# Altium project Control_Board_Model_C.PrjPcb (part 2 of 3)

## Sheet Motor Connection.SchDoc: Motor Connection
size A4; DocumentNumber: 12; SheetNumber: 12; SheetTotal: 51
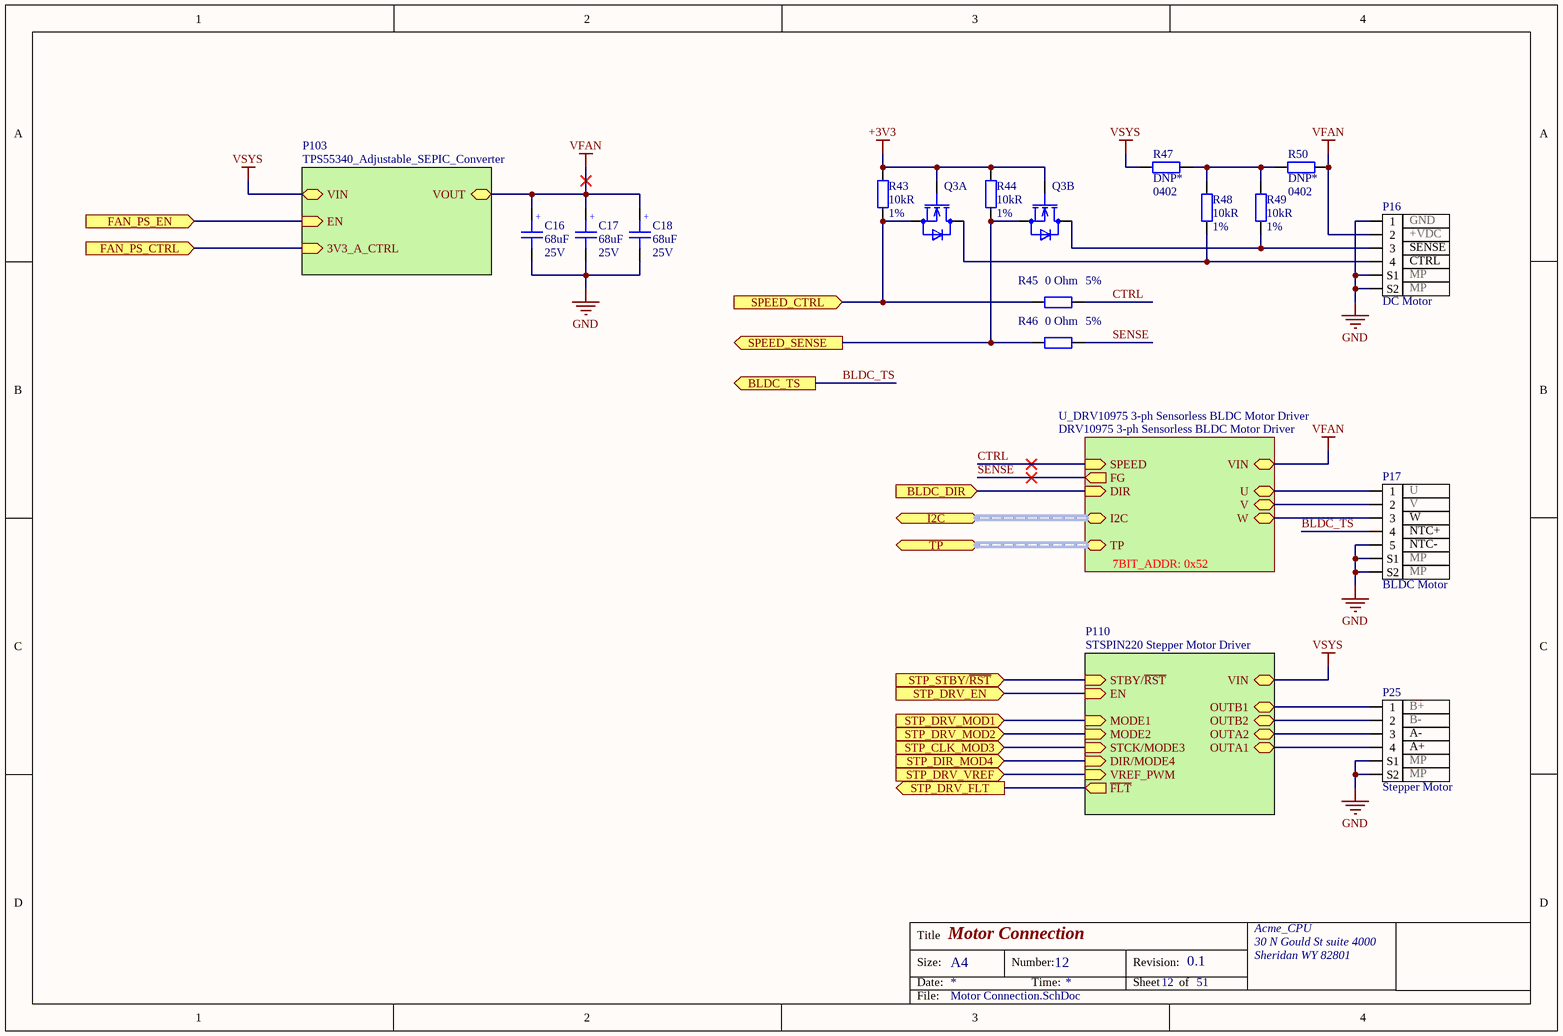
[diagram p5: Motor Connection.SchDoc]

### Parts
C16  Capacitance: 68uF  Rated Voltage: 25V  [WCAP-ASLI_6.3x5.5]  (hidden comment: CAP ALUM 68 UF 20% 25 V SMD)
C17  Capacitance: 68uF  Rated Voltage: 25V  [WCAP-ASLI_6.3x5.5]  (hidden comment: CAP ALUM 68 UF 20% 25 V SMD)
C18  Capacitance: 68uF  Rated Voltage: 25V  [WCAP-ASLI_6.3x5.5]  (hidden comment: CAP ALUM 68 UF 20% 25 V SMD)
P16  DC Motor  pin_1: GND  pin_2: +VDC  pin_MP1: MP  pin_3: SENSE  pin_4: CTRL  [CONN_JST_S4B-ZR-SM4A-TF(LF)(SN)]
P17  BLDC Motor  pin_1: U  pin_2: V  pin_MP1: MP  pin_3: W  pin_4: NTC+  pin_5: NTC-  [CONN_JST_S5B-ZR-SM4A-TF(LF)(SN)]
P25  Stepper Motor  pin_1: B+  pin_2: B-  pin_MP1: MP  pin_3: A-  pin_4: A+  [CONN_JST_SM4B-NSHSS-TB(LF)(SN)]
Q3  DMN32D2LV-7  [SON_400UV-7_DIO]  (value not drawn)  (parts A,B of 2)
R43  Resistance: 10kR  Tolerance: 1%  [R0402]  (hidden comment: RES SMD 10K OHM 1% 1/16W 0402)
R44  Resistance: 10kR  Tolerance: 1%  [R0402]  (hidden comment: RES SMD 10K OHM 1% 1/16W 0402)
R45  Tolerance: 5%  Resistance: 0 Ohm  [R0402]  (hidden comment: RES SMD 0 OHM JUMPER 1/16W 0402)
R46  Tolerance: 5%  Resistance: 0 Ohm  [R0402]  (hidden comment: RES SMD 0 OHM JUMPER 1/16W 0402)
R47  DNP*  Case/Package: 0402  [R0402]  (no BOM)
R48  Resistance: 10kR  Tolerance: 1%  [R0402]  (hidden comment: RES SMD 10K OHM 1% 1/16W 0402)
R49  Resistance: 10kR  Tolerance: 1%  [R0402]  (hidden comment: RES SMD 10K OHM 1% 1/16W 0402)
R50  DNP*  Case/Package: 0402  [R0402]  (no BOM)

### Sub-sheets
P103 = TPS55340_Adjustable_SEPIC_Converter (file not in this document): EN (in), VIN, VOUT, 3V3_A_CTRL (in)
P110 = STSPIN220 Stepper Motor Driver (file not in this document): MODE1 (in), OUTB1, VREF_PWM (in), EN (in), MODE2 (in), OUTB2, OUTA2, DIR/MODE4 (in), STCK/MODE3 (in), ~{FLT} (out), STBY/~{RST} (in), OUTA1, VIN
U_DRV10975 3-ph Sensorless BLDC Motor Driver = DRV10975 3-ph Sensorless BLDC Motor Driver (file not in this document): U, V, W, VIN, SPEED (in), DIR (in), FG (out), I2C (harness I2C), TP (harness DRV10975_TP)  | 7BIT_ADDR: 0x52

### Ports
BLDC_DIR (in), BLDC_TS (out), FAN_PS_CTRL (in), FAN_PS_EN (in), I2C (harness I2C), SPEED_CTRL (in), SPEED_SENSE (out), STP_CLK_MOD3 (in), STP_DIR_MOD4 (in), STP_DRV_EN (in), STP_DRV_FLT (out), STP_DRV_MOD1 (in), STP_DRV_MOD2 (in), STP_DRV_VREF (in), STP_STBY/~{RST} (in), TP (harness DRV10975_TP)

### Nets
+3V3: Q3.2(G) Q3.5(G) R43.1 R44.1
GND: C16.2 C17.2 C18.2 P16.1 P16.S1 P16.S2 P17.5 P17.S1 P17.S2 P25.S1 P25.S2
VFAN: C16.1 C17.1 C18.1 P16.2 R50.2 ; sheet P103/VOUT, sheet U_DRV10975 3-ph Sensorless BLDC Motor Driver/VIN
VSYS: R47.1 ; sheet P110/VIN, sheet P103/VIN
BLDC_TS: P17.4 ; port BLDC_TS
CTRL: R45.2 ; sheet U_DRV10975 3-ph Sensorless BLDC Motor Driver/SPEED
FAN_PS_CTRL: port FAN_PS_CTRL, sheet P103/3V3_A_CTRL
MOTOR.IO0: port FAN_PS_EN, sheet P103/EN
MOTOR.IO1: port BLDC_DIR, sheet U_DRV10975 3-ph Sensorless BLDC Motor Driver/DIR
MOTOR.IO2: port STP_STBY/~{RST}, sheet P110/STBY/~{RST}
MOTOR.IO3: port STP_DRV_EN, sheet P110/EN
MOTOR.IO4: port STP_DRV_MOD1, sheet P110/MODE1
MOTOR.IO5: port STP_DRV_MOD2, sheet P110/MODE2
MOTOR.IO6: port STP_DIR_MOD4, sheet P110/DIR/MODE4
MOTOR.IO7: port STP_DRV_FLT, sheet P110/~{FLT}
PA0: Q3.4(S) R44.2 R46.1 ; port SPEED_SENSE
PA1: Q3.1(S) R43.2 R45.1 ; port SPEED_CTRL
PB9: port STP_CLK_MOD3, sheet P110/STCK/MODE3
PD13: port STP_DRV_VREF, sheet P110/VREF_PWM
SENSE: R46.2 ; sheet U_DRV10975 3-ph Sensorless BLDC Motor Driver/FG
NetP16_3: P16.3 Q3.3(D) R49.2
NetP16_4: P16.4 Q3.6(D) R48.2
NetP17_1: P17.1 ; sheet U_DRV10975 3-ph Sensorless BLDC Motor Driver/U
NetP17_2: P17.2 ; sheet U_DRV10975 3-ph Sensorless BLDC Motor Driver/V
NetP17_3: P17.3 ; sheet U_DRV10975 3-ph Sensorless BLDC Motor Driver/W
NetP25_1: P25.1 ; sheet P110/OUTB1
NetP25_2: P25.2 ; sheet P110/OUTB2
NetP25_3: P25.3 ; sheet P110/OUTA2
NetP25_4: P25.4 ; sheet P110/OUTA1
NetR47_2: R47.2 R48.1 R49.1 R50.1

### Buses and harness runs
harness port I2C = sheet U_DRV10975 3-ph Sensorless BLDC Motor Driver/I2C
harness port TP = sheet U_DRV10975 3-ph Sensorless BLDC Motor Driver/TP

### Notes on the sheet
- Title
- Size:
- Date:
- A4
- Number:
- Time:
- Revision:
- Sheet
- of
- File:
- (in symbol CAP ALUM 68 UF 20% 25 V SMD) +

### Library data of the parts
C16-C18 = CAP ALUM 68 UF 20% 25 V SMD: 68µF 25V Aluminum Electrolytic Capacitors Radial, Can - SMD  2000 Hrs @ 105°C; Manufacturer: Wurth Elektronik; Manufacturer Part Number: 865080443009; Dissipation Factor: 14%; Endurance: 2000h; Leakage Current: 17uA; Ripple Current: 240mA; Capacitance Tolerance: +/-20%; Technical Reference: ASED055680M025DVCTBB000; Supplier 1: Digi-Key; Packaging: Tape and Reel; ComponentLink1URL: http://www.we-online.de; ComponentLink1Description: Manufacturer; Supplier Part Number 1: 732-8437-1-ND; Diameter: 6.3mm; Height: 5.5mm; ComponentLink2URL: https://www.we-online.com/catalog/datasheet/865080443009.pdf; ComponentLink2Description: Datasheet; Mounting Technology: SMT; Operating Temperature: -55 to +105degC; Published Date: May 2020; Mount: Surface Mount
P16 = CONN HEADER SMD R/A 4POS 1.5MM: Connector Header Surface Mount, Right Angle 4 position 0.059" (1.50mm); Manufacturer: JST; Manufacturer Part Number: S4B-ZR-SM4A-TF(LF)(SN); Number of Positions: 4; Connector Type: Male Pin; Contact Resistance: 30mR; Max Current Rating: 1A; Voltage Rating: 50V; Gender: Male; Pitch: 1.5mm; Supplier 1: Digi-Key; Stock 1: 0; Mount: Surface Mount; Color: Natural; Contact Plating: Tin,Copper; Contact Material: Brass,Tin; Housing Color: Beige; Housing Material: Polyamide; Min Operating Temperature: -25°C; Max Operating Temperature: 85°C; Number of Rows: 1; Packaging: Tape and Reel; Series: ZH; Contact Type: Male Pin; Termination: Solder; Current Rating: 1A; Fastening Type: Detent; Max Voltage Rating (AC): 50V; Max Voltage Rating (DC): 50V; Number of Contacts: 4; Orientation: Right Angle; Length: 9mm; Width: 3.5mm; Height: 7.2mm; Depth: 6.5mm; Lead Free: Lead Free; ComponentLink1URL: http://www.jst-mfg.com/product/pdf/eng/eZH.pdf?src-supplier=Digi-Key; ComponentLink1Description: http://www.jst-mfg.com/product/pdf/eng/eZH.pdf?src-supplier=Digi-Key; ComponentLink2URL: http://uk.rs-online.com/webdocs/13ed/0900766b813ed0da.pdf?src-supplier=RSComponents; ComponentLink2Description: http://uk.rs-online.com/webdocs/13ed/0900766b813ed0da.pdf?src-supplier=RSComponents; ComponentLink3URL: https://www.verical.com/server-webapp/html/getDatasheet?partID=646289&src-supplier=Verical; ComponentLink3Description: https://www.verical.com/server-webapp/html/getDatasheet?partID=646289&src-supplier=Verical; ComponentLink4URL: https://www.verical.com/server-webapp/html/getDatasheet?partID=558977&src-supplier=Verical; ComponentLink4Description: https://www.verical.com/server-webapp/html/getDatasheet?partID=558977&src-supplier=Verical; Supplier Part Number 1: 455-1695-1-ND; pin_MP2: MP
P17 = CONN HEADER SMD R/A 5POS 1.5MM: Connector Header Surface Mount, Right Angle 5 position 0.059" (1.50mm); Manufacturer: JST; Manufacturer Part Number: S5B-ZR-SM4A-TF(LF)(SN); Number of Positions: 5; Connector Type: Male Pin; Contact Resistance: 30mR; Current Rating: 1A; Voltage Rating: 50V; Gender: Male; Pitch: 1.5mm; Supplier 1: Digi-Key; Stock 1: 0; Mount: Surface Mount; Color: Natural; Contact Plating: Tin,Copper; Contact Material: Brass,Tin; Housing Material: Polyamide; Housing Color: Beige; Min Operating Temperature: -25°C; Max Operating Temperature: 85°C; Number of Rows: 1; Packaging: Tape and Reel; Series: ZH; Contact Type: Male Pin; Termination: Solder; Max Current Rating: 1A; Fastening Type: Detent; Max Voltage Rating (AC): 50V; Number of Contacts: 5; Orientation: Right Angle; Length: 10.5mm; Width: 3.5mm; Height: 7.2mm; Depth: 6.5mm; REACH SVHC: Unknown; Lead Free: Lead Free; ComponentLink1URL: http://www.farnell.com/datasheets/2322661.pdf?src-supplier=Element14; ComponentLink1Description: http://www.farnell.com/datasheets/2322661.pdf?src-supplier=Element14; ComponentLink2URL: http://www.jst-mfg.com/product/pdf/eng/eZH.pdf?src-supplier=Digi-Key; ComponentLink2Description: http://www.jst-mfg.com/product/pdf/eng/eZH.pdf?src-supplier=Digi-Key; ComponentLink3URL: https://www.verical.com/server-webapp/html/getDatasheet?partID=640788&src-supplier=Verical; ComponentLink3Description: https://www.verical.com/server-webapp/html/getDatasheet?partID=640788&src-supplier=Verical; ComponentLink4URL: http://www.jst-mfg.com/product/pdf/eng/eZR.pdf?src-supplier=Future+Electronics; ComponentLink4Description: http://www.jst-mfg.com/product/pdf/eng/eZR.pdf?src-supplier=Future+Electronics; Supplier Part Number 1: 455-1696-1-ND; pin_MP2: MP
P25 = CONN HEADER SMD R/A 4POS 1MM: Connector Header Surface Mount, Right Angle 4 position 0.039" (1.00mm); Manufacturer: JST; Manufacturer Part Number: SM04B-NSHSS-TB(LF)(SN); Number of Positions: 4; Connector Type: Outer Shroud Contact; Pitch: 0.039inch; Supplier 1: Digi-Key; Stock 1: 27326; Pricing 1: 1=0.79, 10=0.694, 100=0.5985, 500=0.4897 (USD); Mount: Surface Mount; Color: Natural; Contact Plating: Tin; Fastening Type: Latch; Packaging: Tape and Reel; Number of Rows: 1; Termination: Solder; Series: NSH; Contact Type: Outer Shroud Contact; Supplier Part Number 1: 455-2774-1-ND; pin_MP2: MP
Q3 = ARRAY MOSFET 2N-CH 30V 0.4A SOT-563: Mosfet Array 2 N-Channel (Dual) 30V 400mA 400mW Surface Mount SOT-563; Manufacturer: Diodes; Gate to Source Voltage (Vgs): 10V; Rds On Max: 1.2R; Input Capacitance: 39pF; Number of Channels: 2; Supplier 1: Digi-Key; Manufacturer Part Number: DMN32D2LV-7; Stock 1: 141366; Pricing 1: 1=0.39, 10=0.338, 25=0.3152, 100=0.234, 500=0.1827, 1000=0.1485 (USD); Mount: Surface Mount; Min Operating Temperature: -55°C; Max Operating Temperature: 150°C; Continuous Drain Current (ID): 400mA; Package Quantity: 3000; Packaging: Tape and Reel; Drain to Source Voltage (Vdss): 30V; Max Power Dissipation: 400mW; Drain to Source Breakdown Voltage: 30V; Drain to Source Resistance: 1.2R; Element Configuration: Dual; FET Type: 2 N-Channel; Length: 1.6mm; Height: 0.6mm; Width: 1.2mm; Radiation Hardening: No; REACH SVHC: No SVHC; ComponentLink1URL: https://www.diodes.com/assets/Datasheets/ds31121.pdf?src-supplier=Digi-Key; ComponentLink1Description: https://www.diodes.com/assets/Datasheets/ds31121.pdf?src-supplier=Digi-Key; ComponentLink2URL: http://www.mouser.com/ds/2/115/ds31121-89496.pdf?src-supplier=Mouser; ComponentLink2Description: http://www.mouser.com/ds/2/115/ds31121-89496.pdf?src-supplier=Mouser; ComponentLink3URL: http://www.diodes.com///datasheets/ds31121.pdf?src-supplier=Avnet; ComponentLink3Description: http://www.diodes.com///datasheets/ds31121.pdf?src-supplier=Avnet; Supplier Part Number 1: DMN32D2LV-7DICT-ND; Case/Package: SOT-563; Weight: 0.000106oz; Polarity: N-CHANNEL; Series: -
R43 R44 R48 R49 = RES SMD 10K OHM 1% 1/16W 0402: 10 kOhms ±1% 0.063W, 1/16W Chip Resistor 0402 (1005 Metric) Moisture Resistant Thick Film; Manufacturer Part Number: RC0402FR-0710KP; Manufacturer: Yageo; Temperature Coefficient: 150ppm/°C; Max Power Dissipation: 63mW; Supplier 1: Digi-Key; Stock 1: 839368; Pricing 1: 1=0.1, 10=0.035, 100=0.014, 1000=0.0063, 2500=0.0055, 5000=0.0045 (USD); Case Code (Imperial): 0402; Case Code (Metric): 1005; Min Operating Temperature: -55°C; Max Operating Temperature: 155°C; Composition: Thick Film; Packaging: Tape and Reel; Number of Terminations: 2; Length: 0.039inch; Height: 0.016inch; Width: 0.02inch; ComponentLink1URL: http://www.yageo.com/NewPortal/yageodocoutput?fileName=/pdf/R-Chip/PYu-RC_51_RoHS_P_0.pdf&src-supplier=Digi-Key; ComponentLink1Description: http://www.yageo.com/NewPortal/yageodocoutput?fileName=/pdf/R-Chip/PYu-RC_51_RoHS_P_0.pdf&src-supplier=Digi-Key; Supplier Part Number 1: YAG1249CT-ND; Case/Package: 0402; Features: Moisture Resistant; Mount: Surface Mount
R45 R46 = RES SMD 0 OHM JUMPER 1/16W 0402: 0 Ohms Jumper 0.063W, 1/16W Chip Resistor 0402 (1005 Metric) Moisture Resistant Thick Film; Manufacturer: Yageo; Manufacturer Part Number: RC0402JR-070RL; Power Rating: 62.5mW; Voltage Rating: 50V; Max Power Dissipation: 63mW; Temperature Coefficient: 200ppm/°C; Supplier 1: Digi-Key; Stock 1: 46057148; Pricing 1: 1=0.1, 10=0.013, 25=0.0092, 50=0.0072, 100=0.0053, 250=0.004, 500=0.0032, 1000=0.0024, 5000=0.0017 (USD); Contact Plating: Tin,Matte; Case Code (Metric): 1005; Case Code (Imperial): 0402; Min Operating Temperature: -55°C; Max Operating Temperature: 155°C; Packaging: Tape and Reel; Composition: Thick Film; Package Quantity: 1; Number of Terminations: 2; Termination: SMD/SMT; Military Standard: Not; Features: Moisture Resistant; Length: 1mm; Height: 0.016inch; Width: 0.02inch; Depth: 0.5mm; Radiation Hardening: No; REACH SVHC: Unknown; Lead Free: Lead Free; ComponentLink1URL: http://www.yageo.com/documents/recent/PYu-RC_Group_51_RoHS_L_10.pdf?src-supplier=Digi-Key; ComponentLink1Description: http://www.yageo.com/documents/recent/PYu-RC_Group_51_RoHS_L_10.pdf?src-supplier=Digi-Key; ComponentLink2URL: http://www.yageo.com/documents/recent/PYu-RC0402_51_RoHS_L_6.pdf?src-supplier=Avnet+Europe; ComponentLink2Description: http://www.yageo.com/documents/recent/PYu-RC0402_51_RoHS_L_6.pdf?src-supplier=Avnet+Europe; ComponentLink3URL: http://www.farnell.com/datasheets/1018594.pdf?src-supplier=Element14; ComponentLink3Description: http://www.farnell.com/datasheets/1018594.pdf?src-supplier=Element14; ComponentLink4URL: https://www.verical.com/server-webapp/html/getDatasheet?partID=326379&src-supplier=Verical; ComponentLink4Description: https://www.verical.com/server-webapp/html/getDatasheet?partID=326379&src-supplier=Verical; ComponentLink5URL: http://www.farnell.com/datasheets/2167052.pdf?src-supplier=Element14; ComponentLink5Description: http://www.farnell.com/datasheets/2167052.pdf?src-supplier=Element14; Supplier Part Number 1: 311-0.0JRCT-ND; Case/Package: 0402; Mount: Surface Mount
R47 R50 = RES SMD NO BOM 0402: Placeholder for a 0402 resistor

## Sheet Sensor Connection.SchDoc: Sensor Connection
size A4; DocumentNumber: 13; SheetNumber: 13; SheetTotal: 51
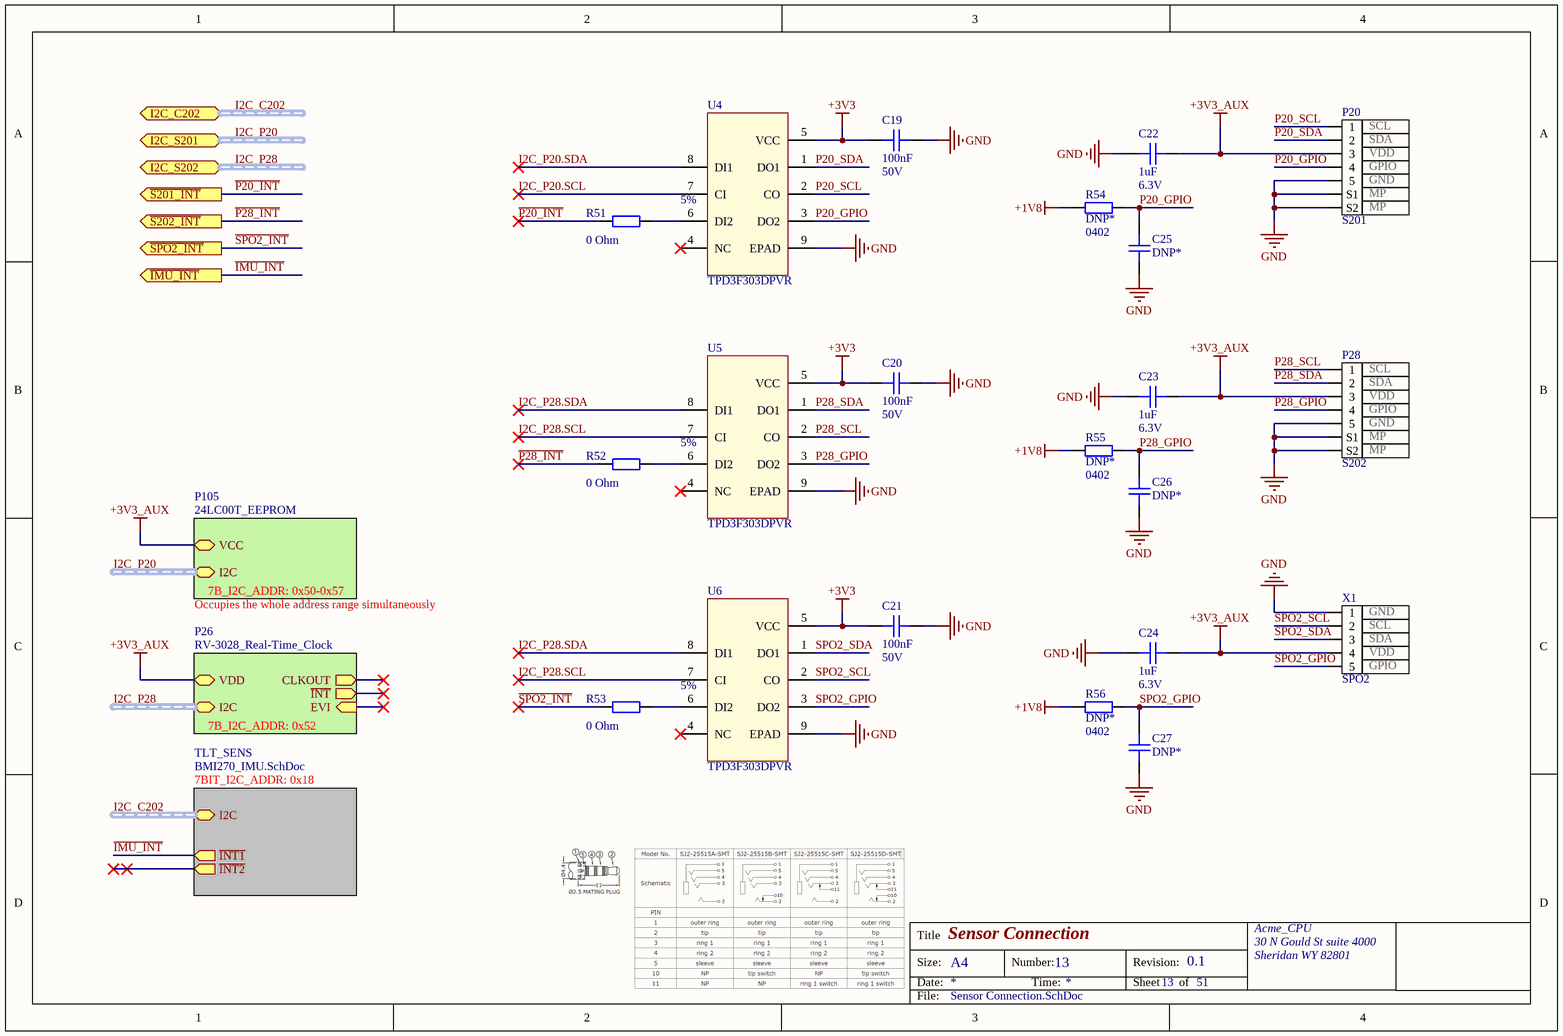
[diagram p6: Sensor Connection.SchDoc]

### Parts
C19  Capacitance: 100nF  Voltage: 50V  [C0402]  (hidden comment: CAP CER 0.1UF 50V X7R 0402)
C20  Capacitance: 100nF  Voltage: 50V  [C0402]  (hidden comment: CAP CER 0.1UF 50V X7R 0402)
C21  Capacitance: 100nF  Voltage: 50V  [C0402]  (hidden comment: CAP CER 0.1UF 50V X7R 0402)
C22  Capacitance: 1uF  Voltage Rating: 6.3V  [C0402]  (hidden comment: CAP CER 1UF 6.3V X5R 0402)
C23  Capacitance: 1uF  Voltage Rating: 6.3V  [C0402]  (hidden comment: CAP CER 1UF 6.3V X5R 0402)
C24  Capacitance: 1uF  Voltage Rating: 6.3V  [C0402]  (hidden comment: CAP CER 1UF 6.3V X5R 0402)
C25  DNP*  [C0402]  (no BOM)
C26  DNP*  [C0402]  (no BOM)
C27  DNP*  [C0402]  (no BOM)
P20  S201  pin_1: SCL  pin_2: SDA  pin_3: VDD  pin_4: GPIO  pin_5: GND  pin_MP1: MP  [CONN_0545500571]
P28  S202  pin_1: SCL  pin_2: SDA  pin_3: VDD  pin_4: GPIO  pin_5: GND  pin_MP1: MP  [CONN_0545500571]
R51  Tolerance: 5%  Resistance: 0 Ohm  [R0402]  (hidden comment: RES SMD 0 OHM JUMPER 1/16W 0402)
R52  Tolerance: 5%  Resistance: 0 Ohm  [R0402]  (hidden comment: RES SMD 0 OHM JUMPER 1/16W 0402)
R53  Tolerance: 5%  Resistance: 0 Ohm  [R0402]  (hidden comment: RES SMD 0 OHM JUMPER 1/16W 0402)
R54  DNP*  Case/Package: 0402  [R0402]  (no BOM)
R55  DNP*  Case/Package: 0402  [R0402]  (no BOM)
R56  DNP*  Case/Package: 0402  [R0402]  (no BOM)
U4  TPD3F303DPVR  [DPV8_1P7X0P4]
U5  TPD3F303DPVR  [DPV8_1P7X0P4]
U6  TPD3F303DPVR  [DPV8_1P7X0P4]
X1  SPO2  pin_1: GND  pin_2: SCL  pin_3: SDA  pin_4: VDD  pin_5: GPIO  [CUI_SJ2-25515A-SMT-TR]

### Sub-sheets
P26 = RV-3028_Real-Time_Clock (file not in this document): I2C (harness I2C), EVI (in), CLKOUT (out), ~{INT} (out), VDD  | 7B_I2C_ADDR: 0x52
P105 = 24LC00T_EEPROM (file not in this document): I2C (harness I2C), VCC  | 7B_I2C_ADDR: 0x50-0x57; : Occupies the whole address range simultaneously
TLT_SENS = BMI270_IMU.SchDoc: ~{INT2} (out), ~{INT1} (out), I2C (harness I2C)  | 7BIT_I2C_ADDR: 0x18

### Ports
I2C_C202 (harness I2C), I2C_S201 (harness I2C), I2C_S202 (harness I2C), ~{IMU_INT} (out), ~{S201_INT} (out), ~{S202_INT} (out), ~{SPO2_INT} (out)

### Nets
+1V8: R54.2 R55.2 R56.2
+3V3: C19.1 C20.1 C21.1 U4.5(VCC) U5.5(VCC) U6.5(VCC)
+3V3_AUX: C22.2 C23.2 C24.2 P20.3 P28.3 X1.4 ; sheet P105/VCC, sheet P26/VDD
GND: C19.2 C20.2 C21.2 C22.1 C23.1 C24.1 C25.1 C26.1 C27.1 P20.0(S1) P20.5 P28.0(S1) P28.5 U4.9(EPAD) U5.9(EPAD) U6.9(EPAD) X1.1
~{IMU_INT}: port ~{IMU_INT}, sheet TLT_SENS/~{INT1}
~{P20_INT}: R51.1 ; port ~{S201_INT}
~{P28_INT}: R52.1 ; port ~{S202_INT}
~{SPO2_INT}: R53.1 ; port ~{SPO2_INT}
I2C_P20.SCL: U4.7(CI)
I2C_P20.SDA: U4.8(DI1)
I2C_P28.SCL: U5.7(CI) U6.7(CI)
I2C_P28.SDA: U5.8(DI1) U6.8(DI1)
P20_GPIO: C25.2 P20.4 R54.1 U4.3(DO2)
P20_SCL: P20.1 U4.2(CO)
P20_SDA: P20.2 U4.1(DO1)
P28_GPIO: C26.2 P28.4 R55.1 U5.3(DO2)
P28_SCL: P28.1 U5.2(CO)
P28_SDA: P28.2 U5.1(DO1)
SPO2_GPIO: C27.2 R56.1 U6.3(DO2) X1.5
SPO2_SCL: U6.2(CO) X1.2
SPO2_SDA: U6.1(DO1) X1.3
NetR51_2: R51.2 U4.6(DI2)
NetR52_2: R52.2 U5.6(DI2)
NetR53_2: R53.2 U6.6(DI2)

Not connected (* = marked no-connect by the designer): U4 4(NC)*; U5 4(NC)*; U6 4(NC)*

### Buses and harness runs
harness I2C_C202 = port I2C_C202
harness I2C_C202 = sheet TLT_SENS/I2C
harness I2C_P20 = port I2C_S201
harness I2C_P20 = sheet P105/I2C
harness I2C_P28 = port I2C_S202
harness I2C_P28 = sheet P26/I2C

### Notes on the sheet
- Title
- Size:
- Date:
- A4
- Number:
- Time:
- Revision:
- Sheet
- of
- File:

### Library data of the parts
C19-C21 = CAP CER 0.1UF 50V X7R 0402: 0.1µF ±10% 50V Ceramic Capacitor X7R 0402 (1005 Metric); Manufacturer: TDK; Manufacturer Part Number: CGA2B3X7R1H104K050BB; Supplier 1: Digi-Key; Stock 1: 2925303; Pricing 1: 1=0.17, 10=0.118, 50=0.0668, 100=0.0553, 500=0.0388, 1000=0.0321, 2500=0.0299, 5000=0.0273 (USD); Mount: Surface Mount; Case/Package: 0402; Weight: 2.3E-05oz; Case Code (Metric): 1005; Case Code (Imperial): 0402; Min Operating Temperature: -55°C; Max Operating Temperature: 125°C; Voltage Rating: 50V; Tolerance: 10%; Packaging: Tape and Reel; Package Quantity: 1; Voltage Rating (DC): 50V; Dielectric: X7R; Termination: SMD/SMT; Composition: Ceramic; Length: 1mm; Height: 0.5mm; Width: 0.02inch; Thickness: 0.022inch; Depth: 0.5mm; Ratings: AEC-Q200; REACH SVHC: No SVHC; Lead Free: Lead Free; ComponentLink1URL: http://product.tdk.com/capacitor/mlcc/en/documents/mlccspec_automotive_general_midvoltage_en.pdf?src-supplier=Future+Electronics; ComponentLink1Description: http://product.tdk.com/capacitor/mlcc/en/documents/mlccspec_automotive_general_midvoltage_en.pdf?src-supplier=Future+Electronics; ComponentLink2URL: http://www.farnell.com/datasheets/1807242.pdf?src-supplier=Element14; ComponentLink2Description: http://www.farnell.com/datasheets/1807242.pdf?src-supplier=Element14; ComponentLink3URL: http://www.mouser.com/ds/2/400/lcc_automotive_general_en-843974.pdf?src-supplier=Mouser; ComponentLink3Description: http://www.mouser.com/ds/2/400/lcc_automotive_general_en-843974.pdf?src-supplier=Mouser; ComponentLink4URL: http://www.farnell.com/datasheets/1936565.pdf?src-supplier=Element14; ComponentLink4Description: http://www.farnell.com/datasheets/1936565.pdf?src-supplier=Element14; ComponentLink5URL: http://www.farnell.com/datasheets/1735392.pdf?src-supplier=Element14; ComponentLink5Description: http://www.farnell.com/datasheets/1735392.pdf?src-supplier=Element14; Supplier Part Number 1: 445-6899-1-ND
C22-C24 = CAP CER 1UF 6.3V X5R 0402: 1µF ±10% 6.3V Ceramic Capacitor X5R 0402 (1005 Metric); Manufacturer: Yageo; Manufacturer Part Number: CC0402KRX5R5BB105; Supplier 1: Digi-Key; Stock 1: 34926286; Pricing 1: 1=0.1, 10=0.05, 50=0.0272, 100=0.0222, 500=0.0158, 1000=0.0124, 2500=0.0113, 5000=0.0104 (USD); Mount: Surface Mount; Number of Pins: 2; Case Code (Imperial): 0402; Case Code (Metric): 1005; Min Operating Temperature: -55°C; Max Operating Temperature: 85°C; Tolerance: 10%; Packaging: Tape and Reel; Termination: SMD/SMT; Voltage Rating (DC): 6.3V; Composition: Ceramic; Length: 1mm; Height: 0.5mm; Width: 0.02inch; Thickness: 0.022inch; Depth: 0.5mm; Radiation Hardening: No; Lead Free: Lead Free; Halogen Free: Halogen Free; ComponentLink1URL: http://www.farnell.com/datasheets/70765.pdf?src-supplier=Farnell; ComponentLink1Description: http://www.farnell.com/datasheets/70765.pdf?src-supplier=Farnell; Supplier Part Number 1: 311-1438-1-ND; Dielectric: X5R; Case/Package: 0402; Dielectric Material: Ceramic; Package Quantity: 1; REACH SVHC: No SVHC; ComponentLink2URL: http://www.yageo.com/documents/recent/UPY-GPHC_X5R_4V-to-50V_25.pdf?src-supplier=Digi-Key; ComponentLink2Description: http://www.yageo.com/documents/recent/UPY-GPHC_X5R_4V-to-50V_25.pdf?src-supplier=Digi-Key; ComponentLink3URL: http://www.farnell.com/datasheets/2167237.pdf?src-supplier=Element14; ComponentLink3Description: http://www.farnell.com/datasheets/2167237.pdf?src-supplier=Element14; ComponentLink4URL: http://www.yageo.com/documents/recent/UPY-GPHC_X5R_4V-to-50V_12.pdf?src-supplier=Avnet+Europe; ComponentLink4Description: http://www.yageo.com/documents/recent/UPY-GPHC_X5R_4V-to-50V_12.pdf?src-supplier=Avnet+Europe; ComponentLink5URL: http://www.farnell.com/datasheets/1359354.pdf?src-supplier=Element14; ComponentLink5Description: http://www.farnell.com/datasheets/1359354.pdf?src-supplier=Element14; ComponentLink6URL: http://www.farnell.com/datasheets/70765.pdf?src-supplier=Element14; ComponentLink6Description: http://www.farnell.com/datasheets/70765.pdf?src-supplier=Element14; ComponentLink7URL: http://www.yageo.com/documents/recent/UPY-GPHC_X5R_4V-to-50V_12.pdf?src-supplier=Avnet; ComponentLink7Description: http://www.yageo.com/documents/recent/UPY-GPHC_X5R_4V-to-50V_12.pdf?src-supplier=Avnet
C25-C27 = CAP CER NO_BOM 0402: Placeholder for a 0402 capacitor
P20 P28 = CONN FFC FPC TOP 5POS 0.50MM R/A: 5 Position FFC, FPC Connector Contacts, Top 0.020" (0.50mm) Surface Mount, Right Angle; Manufacturer: Molex; Manufacturer Part Number: 0545500571; Actuator Material: Polyphenylene; Current Rating: 500mA; Voltage Rating: 50V; Number of Positions: 5; Contact Resistance: 40mR; Wire/Cable Type: Straight; Pitch: 0.02inch; Supplier 1: Digi-Key; Stock 1: 20865; Pricing 1: 1=0.98, 10=0.808, 100=0.673, 1000=0.5384 (USD); Mount: Surface Mount; Contact Material: Bronze; Contact Plating: Gold; Housing Material: Polymer; Min Operating Temperature: -20°C; Max Operating Temperature: 85°C; Package Quantity: 1; Packaging: Tape and Reel; Number of Rows: 1; Termination: Solder; Orientation: Right Angle; Length: 7.7mm; Depth: 5mm; Radiation Hardening: No; Flammability Rating: UL94 V-0; ComponentLink1URL: http://www.molex.com/webdocs/datasheets/pdf/en-us/0545500571_FFC_FPC_CONNECTORS.pdf?src-supplier=Avnet; ComponentLink1Description: http://www.molex.com/webdocs/datasheets/pdf/en-us/0545500571_FFC_FPC_CONNECTORS.pdf?src-supplier=Avnet; Supplier Part Number 1: WM8824CT-ND; pin_MP2: MP
R51-R53 = RES SMD 0 OHM JUMPER 1/16W 0402: as R45 on sheet Motor Connection; Supplier 1: Digi-Key; Stock 1: 46057148; Pricing 1: 1=0.1, 10=0.013, 25=0.0092, 50=0.0072, 100=0.0053, 250=0.004, 500=0.0032, 1000=0.0024, 5000=0.0017 (USD); Contact Plating: Tin,Matte; Case Code (Metric): 1005; Case Code (Imperial): 0402; Min Operating Temperature: -55°C; Max Operating Temperature: 155°C; Packaging: Tape and Reel; Composition: Thick Film; Package Quantity: 1; Number of Terminations: 2; Termination: SMD/SMT; Military Standard: Not; Features: Moisture Resistant; Length: 1mm; Height: 0.016inch; Width: 0.02inch; Depth: 0.5mm; Radiation Hardening: No; REACH SVHC: Unknown; Lead Free: Lead Free; ComponentLink1URL: http://www.yageo.com/documents/recent/PYu-RC_Group_51_RoHS_L_10.pdf?src-supplier=Digi-Key; ComponentLink1Description: http://www.yageo.com/documents/recent/PYu-RC_Group_51_RoHS_L_10.pdf?src-supplier=Digi-Key; ComponentLink2URL: http://www.yageo.com/documents/recent/PYu-RC0402_51_RoHS_L_6.pdf?src-supplier=Avnet+Europe; ComponentLink2Description: http://www.yageo.com/documents/recent/PYu-RC0402_51_RoHS_L_6.pdf?src-supplier=Avnet+Europe; ComponentLink3URL: http://www.farnell.com/datasheets/1018594.pdf?src-supplier=Element14; ComponentLink3Description: http://www.farnell.com/datasheets/1018594.pdf?src-supplier=Element14; ComponentLink4URL: https://www.verical.com/server-webapp/html/getDatasheet?partID=326379&src-supplier=Verical; ComponentLink4Description: https://www.verical.com/server-webapp/html/getDatasheet?partID=326379&src-supplier=Verical; ComponentLink5URL: http://www.farnell.com/datasheets/2167052.pdf?src-supplier=Element14; ComponentLink5Description: http://www.farnell.com/datasheets/2167052.pdf?src-supplier=Element14; Supplier Part Number 1: 311-0.0JRCT-ND; Case/Package: 0402; Mount: Surface Mount
R54-R56 = RES SMD NO BOM 0402: Placeholder for a 0402 resistor
U4-U6 = FILTER RC(PI) ESD SMD  8-UFDFN EP: RC (Pi) EMI Filter 2nd Order Low Pass 3 Channel R = 47Ohms, 100Ohms, C = 20pF  8-UFDFN Exposed Pad; Manufacturer: Texas Instruments; Number of Channels: 3; Operating Supply Voltage: 5.5V; ESD Protection: Yes; Clamping Voltage: 10V; Frequency: 308MHz; Supplier 1: Digi-Key; Manufacturer Part Number: TPD3F303DPVR; Stock 1: 4896; Pricing 1: 1=0.85, 10=0.812, 25=0.7856, 50=0.6414, 100=0.576, 250=0.5236, 500=0.4974, 1000=0.4451 (USD); Case/Package: SMD/SMT; Number of Pins: 8; Contact Plating: Gold; Min Operating Temperature: -40°C; Max Operating Temperature: 85°C; Package Quantity: 1; Packaging: Tape and Reel; Capacitance: 20pF; Termination: Flat; Length: 2.2mm; Height: 0.026inch; Width: 0.063inch; Depth: 1.7mm; Radiation Hardening: No; REACH SVHC: No SVHC; Lead Free: Lead Free; ComponentLink1URL: http://www.ti.com/lit/ds/symlink/tpd3f303.pdf?src-supplier=Digi-Key; ComponentLink1Description: http://www.ti.com/lit/ds/symlink/tpd3f303.pdf?src-supplier=Digi-Key; ComponentLink2URL: http://focus.ti.com/lit/ds/symlink/tpd3f303.pdf?src-supplier=Avnet+Europe; ComponentLink2Description: http://focus.ti.com/lit/ds/symlink/tpd3f303.pdf?src-supplier=Avnet+Europe; ComponentLink3URL: https://www.verical.com/server-webapp/html/getDatasheet?partID=302817&src-supplier=Verical; ComponentLink3Description: https://www.verical.com/server-webapp/html/getDatasheet?partID=302817&src-supplier=Verical; ComponentLink4URL: http://www.farnell.com/datasheets/1558442.pdf?src-supplier=Element14; ComponentLink4Description: http://www.farnell.com/datasheets/1558442.pdf?src-supplier=Element14; Supplier Part Number 1: 296-28299-1-ND; Mount: Surface Mount
X1 = AUDIO JACK SJ2-25515A 2.5 MM RT 5 CONDUC: 2.50mm (0.094", 3/32", Sub Mini, Miniature) - Headphone Phone Jack 5 Conductor (TRRRS) Connector Solder; Manufacturer: CUI; Manufacturer Part Number: SJ2-25515A-SMT-TR; Number of Conductors: 5; Number of Ports: 1; Shielding: Unshielded; Gender: Female; Current Rating: 1A; Supplier 1: Digi-Key; Stock 1: 946; Pricing 1: 1=1.35, 10=1.227, 25=1.1524, 50=1.1022, 100=1.0521, 250=0.9519, 500=0.8768 (USD); Mount: Surface Mount; Color: Black; Contact Plating: Gold,Silver; Contact Material: Brass; Housing Material: Nylon; Min Operating Temperature: -25°C; Max Operating Temperature: 85°C; Connector Type: Jack; Orientation: Horizontal; Packaging: Cut Tape; Termination: Solder; ComponentLink1URL: https://www.cui.com/product/resource/digikeypdf/sj2-2551x-smt.pdf?src-supplier=Digi-Key; ComponentLink1Description: https://www.cui.com/product/resource/digikeypdf/sj2-2551x-smt.pdf?src-supplier=Digi-Key; Supplier Part Number 1: CP-SJ2-25515A-SMT-CT-ND

## Sheet BMI270_IMU.SchDoc: BMA253 Orientation Sensor
size A4; DocumentNumber: 21; SheetNumber: 21; SheetTotal: 51
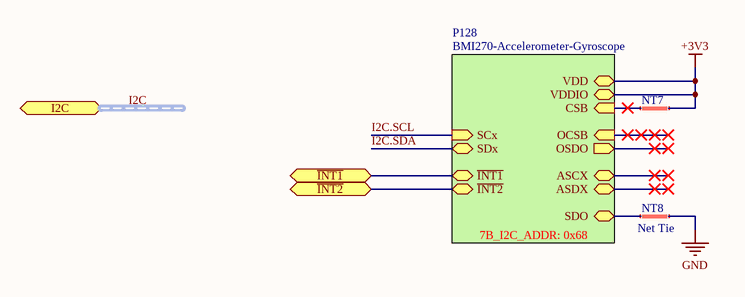
[diagram p7: BMI270_IMU.SchDoc]

### Parts
NT7  Net Tie  [Net Tie 6x30mil]  (value not drawn)  (net tie, no BOM)
NT8  Net Tie  [Net Tie 6x30mil]  (net tie, no BOM)

### Sub-sheets
P128 = BMI270-Accelerometer-Gyroscope (file not in this document): SCx (in), SDx (bidir), VDD, VDDIO, ~{INT1} (bidir), ~{INT2} (bidir), SDO (bidir), ASCX (bidir), ASDX (bidir), OCSB (in), OSDO (out), CSB (in)  | 7B_I2C_ADDR: 0x68

### Ports
I2C (harness I2C), ~{INT1} (bidir), ~{INT2} (bidir)

### Nets
+3V3: NT7.2 ; sheet P128/VDD, sheet P128/VDDIO
GND: NT8.2
~{IMU_INT}: port ~{INT1}, sheet P128/~{INT1}
I2C.SCL: sheet P128/SCx
I2C.SDA: sheet P128/SDx
NetNT7_1: NT7.1 ; sheet P128/CSB
NetNT8_1: NT8.1 ; sheet P128/SDO
(unnamed): port ~{INT2}, sheet P128/~{INT2}

### Buses and harness runs
harness I2C = port I2C

### Notes on the sheet
- Title
- Size:
- Date:
- A4
- Number:
- Time:
- Revision:
- Sheet
- of
- File:

### Library data of the parts
NT7 NT8 = Net Tie Line: ClassName: P128

## Sheet User_Interface.SchDoc: User Interface
size A4; DocumentNumber: 14; SheetNumber: 14; SheetTotal: 51
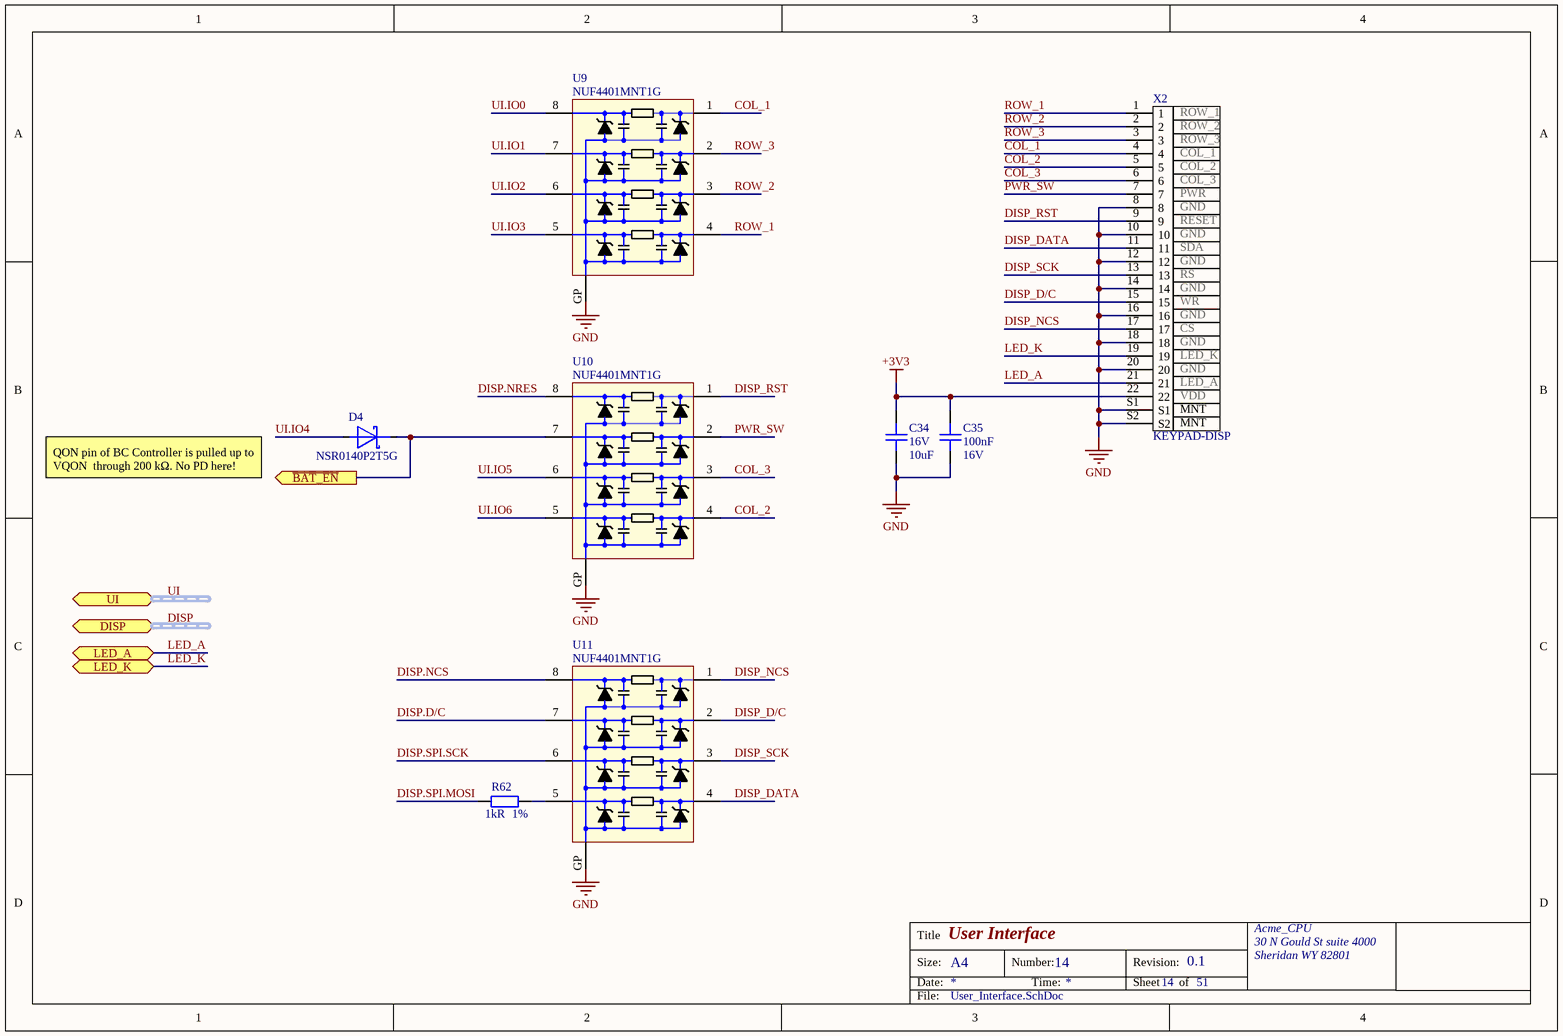
[diagram p8: User_Interface.SchDoc]

### Parts
C34  Voltage Rating: 16V  Capacitance: 10uF  [C0603]  (hidden comment: CAP CER 10UF 16V X5R 0603)
C35  Capacitance: 100nF  Voltage: 16V  [C0402]  (hidden comment: CAP CER 0.1UF 16V X7R 0402)
D4  NSR0140P2T5G  [SODFL100X40-2N]
R62  Tolerance: 1%  Resistance: 1kR  [R0402]  (hidden comment: RES SMD 1K OHM 1% 1/16W 0402)
U9  NUF4401MNT1G  [DFN8]
U10  NUF4401MNT1G  [DFN8]
U11  NUF4401MNT1G  [DFN8]
X2  KEYPAD-DISP  pin_1: ROW_1  pin_2: ROW_2  pin_3: ROW_3  pin_4: COL_1  pin_5: COL_2  pin_6: COL_3  pin_7: PWR  pin_8: GND  pin_9: RESET  pin_11: SDA  pin_13: RS  pin_15: WR  pin_17: CS  pin_19: LED_K  pin_21: LED_A  pin_22: VDD  pin_23: MNT  [CONN_0525592253]

### Ports
DISP (harness DISP_SPI), LED_A, LED_K, UI (harness GPIO), ~{BAT_EN} (out)

### Nets
+3V3: C34.1 C35.1 X2.22
GND: C34.2 C35.2 U9.GP(GND) U10.GP(GND) U11.GP(GND) X2.8 X2.10 X2.12 X2.14 X2.16 X2.18 X2.20 X2.S1 X2.S2
~{UI_BAT_EN}: D4.1(K) U10.7(OUT2) ; port ~{BAT_EN}
COL_1: U9.1(INP1) X2.4
COL_2: U10.4(INP4) X2.5
COL_3: U10.3(INP3) X2.6
DISP.D/C: U11.7(OUT2)
DISP.NCS: U11.8(OUT1)
DISP.NRES: U10.8(OUT1)
DISP.SPI.MOSI: R62.1
DISP.SPI.SCK: U11.6(OUT3)
DISP_D/C: U11.2(INP2) X2.15
DISP_DATA: U11.4(INP4) X2.11
DISP_NCS: U11.1(INP1) X2.17
DISP_RST: U10.1(INP1) X2.9
DISP_SCK: U11.3(INP3) X2.13
LED_A: X2.21 ; port LED_A  [project net LCD_BL_A]
LED_K: X2.19 ; port LED_K  [project net LCD_BL_K]
PWR_SW: U10.2(INP2) X2.7
ROW_1: U9.4(INP4) X2.1
ROW_2: U9.3(INP3) X2.2
ROW_3: U9.2(INP2) X2.3
UI.IO0: U9.8(OUT1)
UI.IO1: U9.7(OUT2)
UI.IO2: U9.6(OUT3)
UI.IO3: U9.5(OUT4)
UI.IO4: D4.2(A)
UI.IO5: U10.6(OUT3)
UI.IO6: U10.5(OUT4)
NetR62_2: R62.2 U11.5(OUT4)

### Buses and harness runs
harness DISP = port DISP
harness UI = port UI

### Notes on the sheet
- QON pin of BC Controller is pulled up to VQON  through 200 kΩ. No PD here!
- Title
- Size:
- Date:
- A4
- Number:
- Time:
- Revision:
- Sheet
- of
- File:

### Library data of the parts
C34 = CAP CER 10UF 16V X5R 0603: 10µF ±10% 16V Ceramic Capacitor X5R 0603 (1608 Metric); Manufacturer: Murata; Manufacturer Part Number: GRM188R61C106KAALJ; Supplier 1: Digi-Key; Stock 1: 5470; Pricing 1: 1=0.39, 10=0.271, 100=0.1628, 500=0.1221, 1000=0.1031, 2500=0.0977, 5000=0.0923 (USD); Mount: Surface Mount; Case Code (Imperial): 0603; Case Code (Metric): 1608; Min Operating Temperature: -55°C; Max Operating Temperature: 85°C; Voltage Rating (DC): 16V; Tolerance: 10%; Packaging: Tape and Reel; Package Quantity: 10000; Dielectric: X5R; Termination: SMD/SMT; Composition: Ceramic; Length: 0.063inch; Height: 0.8mm; Width: 0.031inch; Thickness: 0.037inch; Supplier Part Number 1: 490-12736-1-ND; Case/Package: 0603; Weight: 0.000222oz
C35 = CAP CER 0.1UF 16V X7R 0402: 0.1µF ±10% 16V Ceramic Capacitor X7R 0402 (1005 Metric); Manufacturer Part Number: CC0402KRX7R7BB104; Manufacturer: Yageo; Revision: July-2002: Re-released for DXP Platform.; Order: CC0402KRX7R7BB104; Supplier 1: Digi-Key; Stock 1: 25916830; Pricing 1: 1=0.1, 10=0.031, 100=0.0136, 500=0.0097, 1000=0.0077, 2500=0.007, 5000=0.0064 (USD); Mount: Surface Mount; Number of Pins: 2; Case Code (Metric): 1005; Case Code (Imperial): 0402; Min Operating Temperature: -55°C; Max Operating Temperature: 125°C; Tolerance: 10%; Dielectric: X7R; Voltage Rating: 16V; Voltage Rating (DC): 16V; Packaging: Tape and Reel; Package Quantity: 1; Termination: SMD/SMT; Composition: Ceramic; Length: 1mm; Height: 0.5mm; Width: 0.02inch; Thickness: 0.022inch; Depth: 0.5mm; Radiation Hardening: No; REACH SVHC: No SVHC; Lead Free: Lead Free; Halogen Free: Halogen Free; ComponentLink1URL: http://www.yageo.com/documents/recent/UPY-GPHC_X7R_6.3V-to-50V_8.pdf?src-supplier=Avnet+Europe; ComponentLink1Description: http://www.yageo.com/documents/recent/UPY-GPHC_X7R_6.3V-to-50V_8.pdf?src-supplier=Avnet+Europe; ComponentLink2URL: http://www.yageo.com/documents/recent/UPY-GPHC_X7R_6.3V-to-50V_18.pdf?src-supplier=Digi-Key; ComponentLink2Description: http://www.yageo.com/documents/recent/UPY-GPHC_X7R_6.3V-to-50V_18.pdf?src-supplier=Digi-Key; ComponentLink3URL: http://www.yageo.com/documents/recent/UPY-GPHC_X7R_6.3V-to-50V_8.pdf?src-supplier=Avnet; ComponentLink3Description: http://www.yageo.com/documents/recent/UPY-GPHC_X7R_6.3V-to-50V_8.pdf?src-supplier=Avnet; ComponentLink4URL: http://www.yageo.com/documents/recent/UPY-GPHC_X7R_6.3V-to-50V_18.pdf?src-supplier=Mouser; ComponentLink4Description: http://www.yageo.com/documents/recent/UPY-GPHC_X7R_6.3V-to-50V_18.pdf?src-supplier=Mouser; ComponentLink5URL: http://www.farnell.com/datasheets/2167236.pdf?src-supplier=Element14; ComponentLink5Description: http://www.farnell.com/datasheets/2167236.pdf?src-supplier=Element14; ComponentLink6URL: http://www.farnell.com/datasheets/1489800.pdf?src-supplier=Element14; ComponentLink6Description: http://www.farnell.com/datasheets/1489800.pdf?src-supplier=Element14; Supplier Part Number 1: 311-1338-1-ND
D4 = DIODE SCHOTTKY 30V 70MA SOD923: Diode Schottky 30V 70mA (DC) Surface Mount SOD-923; Manufacturer: ON Semiconductor; Forward Voltage: 350mV; Max Surge Current: 500mA; Max Power Dissipation: 100mW; Max Reverse Leakage Current: 500nA; Element Configuration: Single; Supplier 1: Digi-Key; Manufacturer Part Number: NSR0140P2T5G; Stock 1: 28802; Pricing 1: 1=0.36, 10=0.27, 25=0.2368, 100=0.1284, 500=0.1048, 1000=0.0777, 2500=0.0683 (USD); Case/Package: SOD-923-2; Number of Pins: 2; Contact Plating: Tin,Matte; Min Operating Temperature: -55°C; Max Operating Temperature: 125°C; Forward Current: 70mA; Package Quantity: 1; Packaging: Tape and Reel; Average Rectified Current: 70mA; Max Repetitive Reverse Voltage (Vrrm): 30V; Peak Reverse Current: 500nA; Power Dissipation: 100mW; Peak Non-Repetitive Surge Current: 500mA; Max Forward Surge Current (Ifsm): 500mA; Termination: SMD/SMT; Max Reverse Voltage (DC): 30V; Length: 0.85mm; Height: 0.43mm; Width: 0.65mm; Radiation Hardening: No; REACH SVHC: No SVHC; Lead Free: Lead Free; ComponentLink1URL: http://www.onsemi.com/pub_link/Collateral/NSR0140P2-D.PDF?src-supplier=Future+Electronics; ComponentLink1Description: http://www.onsemi.com/pub_link/Collateral/NSR0140P2-D.PDF?src-supplier=Future+Electronics; ComponentLink2URL: http://www.farnell.com/datasheets/2353885.pdf?src-supplier=Newark; ComponentLink2Description: http://www.farnell.com/datasheets/2353885.pdf?src-supplier=Newark; ComponentLink3URL: http://www.farnell.com/datasheets/86281.pdf?src-supplier=Element14; ComponentLink3Description: http://www.farnell.com/datasheets/86281.pdf?src-supplier=Element14; ComponentLink4URL: http://www.onsemi.com/pub/Collateral/NSR0140P2-D.PDF?src-supplier=Avnet; ComponentLink4Description: http://www.onsemi.com/pub/Collateral/NSR0140P2-D.PDF?src-supplier=Avnet; ComponentLink5URL: http://www.onsemi.com/pub/Collateral/NSR0140P2-D.PDF?src-supplier=Digi-Key; ComponentLink5Description: http://www.onsemi.com/pub/Collateral/NSR0140P2-D.PDF?src-supplier=Digi-Key; ComponentLink6URL: http://www.mouser.com/ds/2/308/NSR0140P2-D-115172.pdf?src-supplier=Mouser; ComponentLink6Description: http://www.mouser.com/ds/2/308/NSR0140P2-D-115172.pdf?src-supplier=Mouser; Supplier Part Number 1: NSR0140P2T5GOSCT-ND; Mount: Surface Mount
R62 = RES SMD 1K OHM 1% 1/16W 0402: 1 kOhms ±1% 0.063W, 1/16W Chip Resistor 0402 (1005 Metric) Moisture Resistant Thick Film; Manufacturer: Yageo; Manufacturer Part Number: RC0402FR-071KL; Temperature Coefficient: 100ppm/°C; Power Rating: 62.5mW; Voltage Rating: 50V; Supplier 1: Digi-Key; Stock 1: 9574509; Pricing 1: 1=0.1, 10=0.015, 100=0.0062, 1000=0.0028, 2500=0.0024, 5000=0.002 (USD); Case/Package: 0402; Number of Pins: 2; Case Code (Imperial): 0402; Case Code (Metric): 1005; Min Operating Temperature: -55°C; Max Operating Temperature: 155°C; Packaging: Tape and Reel; Composition: Thick Film; Voltage Rating (DC): 50V; Termination: SMD/SMT; Military Standard: Not; Length: 1mm; Height: 0.32mm; Width: 0.5mm; Depth: 0.5mm; REACH SVHC: Unknown; Lead Free: Lead Free; ComponentLink1URL: http://www.mouser.com/ds/2/447/PYu-RC0402_51_RoHS_L_6_r-8721.pdf?src-supplier=Mouser; ComponentLink1Description: http://www.mouser.com/ds/2/447/PYu-RC0402_51_RoHS_L_6_r-8721.pdf?src-supplier=Mouser; ComponentLink2URL: http://documents.rs-components.com/techlib://itc_doclist_GB.htm?stockno=6186122&src-supplier=RSComponents; ComponentLink2Description: http://documents.rs-components.com/techlib://itc_doclist_GB.htm?stockno=6186122&src-supplier=RSComponents; ComponentLink3URL: http://www.farnell.com/datasheets/1018594.pdf?src-supplier=Element14; ComponentLink3Description: http://www.farnell.com/datasheets/1018594.pdf?src-supplier=Element14; ComponentLink4URL: http://www.yageo.com/documents/recent/PYu-RC0402_51_RoHS_L_6_r.pdf?src-supplier=Future+Electronics; ComponentLink4Description: http://www.yageo.com/documents/recent/PYu-RC0402_51_RoHS_L_6_r.pdf?src-supplier=Future+Electronics; ComponentLink5URL: http://www.farnell.com/datasheets/2167052.pdf?src-supplier=Element14; ComponentLink5Description: http://www.farnell.com/datasheets/2167052.pdf?src-supplier=Element14; Supplier Part Number 1: 311-1.00KLRCT-ND; Mount: Surface Mount
U9-U11 = FILTER RC(PI) 200 OHM/15PF SMD: EMI filter w/ ESD prot. NUF4401MN 12mm r; Manufacturer: ON Semiconductor; Number of Channels: 4; Frequency: 2.4GHz; Capacitance: 15pF; Number of Elements: 8; Resistance: 200R; Attenuation Value: 35dB; ESD Protection: Yes; Max DC Current: 100nA; DC Resistance (DCR): 230R; Test Frequency: 125MHz; Shielding: Unshielded; Supplier 1: Digi-Key; Manufacturer Part Number: NUF4401MNT1G; Stock 1: 2896; Pricing 1: 1=0.49, 10=0.45, 25=0.4296, 50=0.4158, 100=0.4019, 250=0.3812, 500=0.3188, 1000=0.2474 (USD); Case/Package: DFN; Min Operating Temperature: -40°C; Max Operating Temperature: 85°C; Packaging: Tape and Reel; ComponentLink1URL: http://www.onsemi.com/pub/Collateral/NUF4401MN-D.PDF?src-supplier=Digi-Key; ComponentLink1Description: http://www.onsemi.com/pub/Collateral/NUF4401MN-D.PDF?src-supplier=Digi-Key; ComponentLink2URL: http://www.onsemi.com/pub/Collateral/NUF4401MN-D.PDF?src-supplier=Avnet; ComponentLink2Description: http://www.onsemi.com/pub/Collateral/NUF4401MN-D.PDF?src-supplier=Avnet; ComponentLink3URL: http://www.onsemi.com/pub_link/Collateral/NUF4401MN-D.PDF?src-supplier=Avnet+Europe; ComponentLink3Description: http://www.onsemi.com/pub_link/Collateral/NUF4401MN-D.PDF?src-supplier=Avnet+Europe; ComponentLink4URL: http://www.mouser.com/ds/2/308/NUF4401MN-D-100381.pdf?src-supplier=Mouser; ComponentLink4Description: http://www.mouser.com/ds/2/308/NUF4401MN-D-100381.pdf?src-supplier=Mouser; Supplier Part Number 1: 488-NUF4401MNT1GCT-ND; Number of Pins: 8; Contact Plating: Tin,Matte; Package Quantity: 1; Circuit Type: Filter; Termination: Flat; Number of Lines: 4; Length: 2mm; Height: 1mm; Width: 0.079inch; Depth: 2mm; Radiation Hardening: No; Lead Free: Lead Free; Halogen Free: Halogen Free; Mount: Surface Mount
X2 = CONN 0525592253 FFC VERT 22POS 0.50MM SMD: 22 Position FFC, FPC Connector Contacts, Vertical - 1 Sided 0.020" (0.50mm) Surface Mount; Manufacturer: Molex; Manufacturer Part Number: 52559-2253; Current Rating: 500mA; Voltage Rating: 50V; Number of Positions: 22; Gender: Receptacle; Pitch: 0.5mm; Supplier 1: Digi-Key; Stock 1: 4369; Pricing 1: 1=2.66, 10=2.267, 100=1.8728 (USD); Mount: Surface Mount; Contact Plating: Gold; Contact Material: Bronze; Housing Material: Nylon; Number of Rows: 1; Package Quantity: 1000; Packaging: Tape and Reel; Termination: SMD/SMT; Number of Contacts: 22; Orientation: Vertical; Series: 52559; Number of Circuits: 22; REACH SVHC: Unknown; ComponentLink1URL: http://www.farnell.com/datasheets/1896633.pdf?src-supplier=Element14; ComponentLink1Description: http://www.farnell.com/datasheets/1896633.pdf?src-supplier=Element14; ComponentLink2URL: http://www.mouser.com/ds/2/276/0525592253_FFC_FPC_CONNECTORS-229826.pdf?src-supplier=Mouser; ComponentLink2Description: http://www.mouser.com/ds/2/276/0525592253_FFC_FPC_CONNECTORS-229826.pdf?src-supplier=Mouser; Supplier Part Number 1: WM10988CT-ND; pin_10: GND; pin_12: GND; pin_14: GND; pin_16: GND; pin_18: GND; pin_20: GND; pin_24: MNT

## Sheet Auxiliary.SchDoc: Auxiliary Components
size A4; DocumentNumber: 23; SheetNumber: 23; SheetTotal: 51
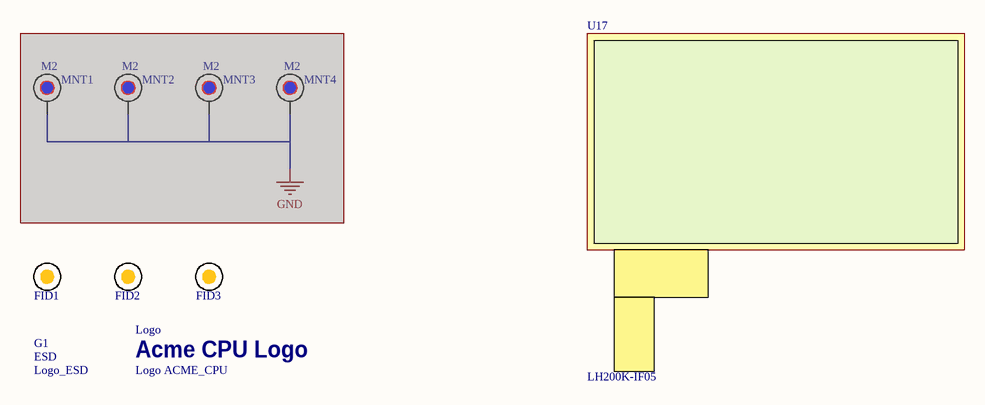
[diagram p9: Auxiliary.SchDoc]

### Parts
FID1  N/A  [Fiducial]  (value not drawn)  (no BOM)
FID2  N/A  [Fiducial]  (value not drawn)  (no BOM)
FID3  N/A  [Fiducial]  (value not drawn)  (no BOM)
G1  Logo_ESD  [Logo_ESD]  (no BOM)
Logo  Logo ACME_CPU  [LOGO_ACME_CPU]  (no BOM)
MNT1  MountHole M2. Nothing to buy or mount  [MountHole_M2]  (value not drawn)  (no BOM)  (masked out: inside a compile mask, not in the netlist)
MNT2  MountHole M2. Nothing to buy or mount  [MountHole_M2]  (value not drawn)  (no BOM)  (masked out: inside a compile mask, not in the netlist)
MNT3  MountHole M2. Nothing to buy or mount  [MountHole_M2]  (value not drawn)  (no BOM)  (masked out: inside a compile mask, not in the netlist)
MNT4  MountHole M2. Nothing to buy or mount  [MountHole_M2]  (value not drawn)  (no BOM)  (masked out: inside a compile mask, not in the netlist)
U17  LH200K-IF05  (mechanical)

### Notes on the sheet
- Title
- Size:
- Date:
- A4
- Number:
- Time:
- Revision:
- Sheet
- of
- File:
- (in symbol Logo ACME_CPU) Acme CPU Logo
- (in symbol Logo_ESD) ESD
- (in symbol MountHole_M2) M2

### Library data of the parts
FID1-FID3 = Fiducial: Fiducial mark.  There is nothing to buy or mount.; ClassName: FiducialMark; CompType: Fiducial; Manufacturer: N/A; MountType: N/A; PackageReference: Fiducial; Manufacturer Part Number: N/A
MNT1-MNT4 = MountHole_M2: PCB Mount Hole. There is nothing to buy or mount.
U17 = MOD LH200K-IF05 240x320 2-inch TFT LCD Display: 2” TFT LCD Display.; Manufacturer: Shenzhen Limito Technology Inc.; Mount: Not Mounted on PCB; Manufacturer Part Number: LH200K-IF05
Logo = Logo ACME_CPU: ClassName: PCB_FEATURE